# Altium schematic sheet HEADERS_1.SchDoc: HEADER
size 420 x 297 mm; SheetNumber: 3; SheetTotal: 12
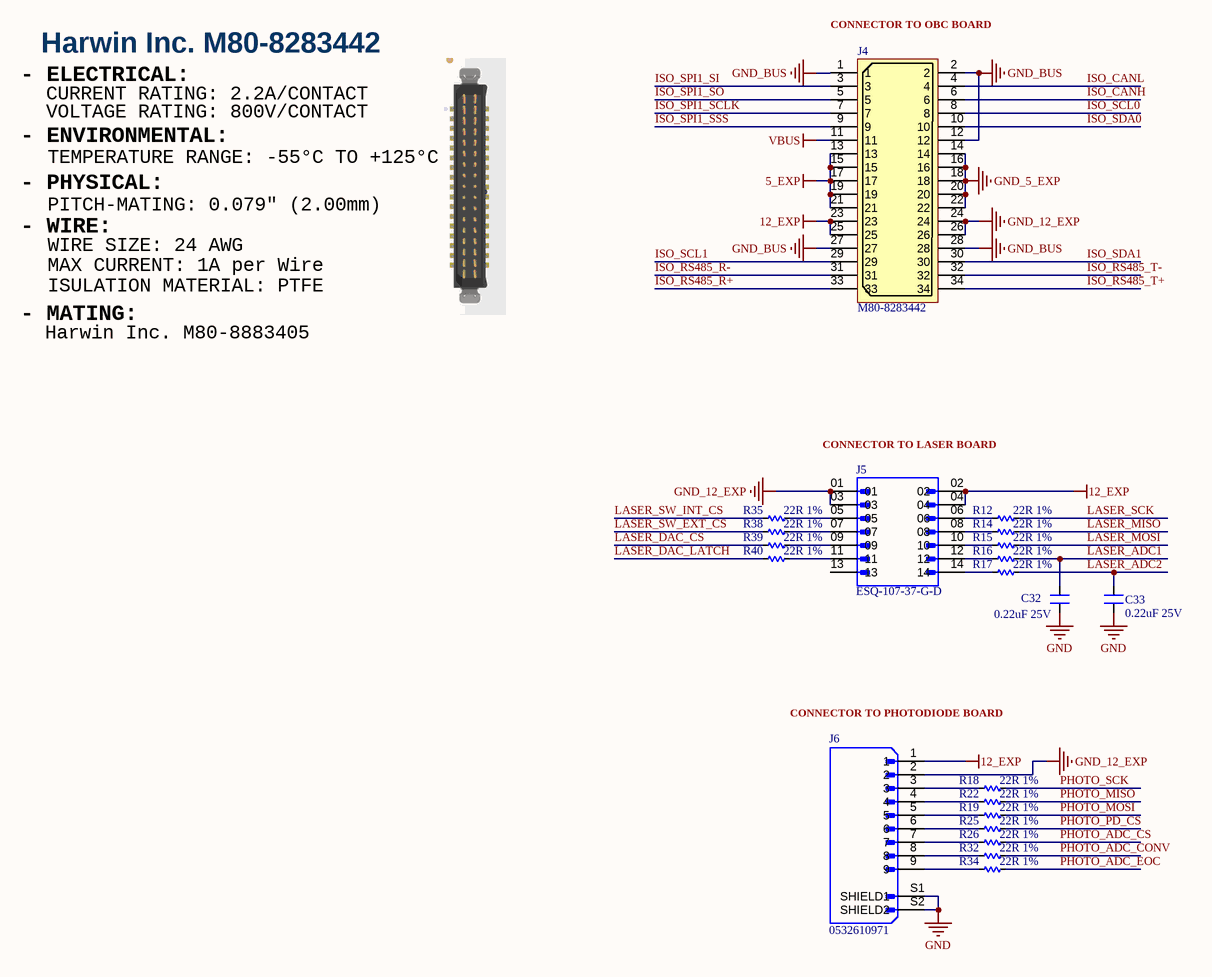
[diagram p0: HEADERS_1.SchDoc]

## Parts
C32  0.22uF 25V  [CN-SMD-0603-EXP-V101]
C33  0.22uF 25V  [CN-SMD-0603-EXP-V101]
J4  M80-8283442  [M80-8283442]
J5  ESQ-107-37-G-D  [ESQ-107-37-G-D]
J6  0532610971  [0532610971]
R12  22R 1%  [RES-SMD-0603-EXP-V101]
R14  22R 1%  [RES-SMD-0603-EXP-V101]
R15  22R 1%  [RES-SMD-0603-EXP-V101]
R16  22R 1%  [RES-SMD-0603-EXP-V101]
R17  22R 1%  [RES-SMD-0603-EXP-V101]
R18  22R 1%  [RES-SMD-0603-EXP-V101]
R19  22R 1%  [RES-SMD-0603-EXP-V101]
R22  22R 1%  [RES-SMD-0603-EXP-V101]
R25  22R 1%  [RES-SMD-0603-EXP-V101]
R26  22R 1%  [RES-SMD-0603-EXP-V101]
R32  22R 1%  [RES-SMD-0603-EXP-V101]
R34  22R 1%  [RES-SMD-0603-EXP-V101]
R35  22R 1%  [RES-SMD-0603-EXP-V101]
R38  22R 1%  [RES-SMD-0603-EXP-V101]
R39  22R 1%  [RES-SMD-0603-EXP-V101]
R40  22R 1%  [RES-SMD-0603-EXP-V101]

## Nets
5_EXP: J4.13 J4.15 J4.17 J4.19 J4.21
12_EXP: J4.23 J4.25 J5.02 J5.04 J6.1
GND: C32.1 C33.1 J6.S1(SHIELD1) J6.S2(SHIELD2)
GND_5_EXP: J4.14 J4.16 J4.18 J4.20 J4.22
GND_12_EXP: J4.24 J4.26 J5.01 J5.03 J6.2
GND_BUS: J4.1 J4.2 J4.12 J4.27 J4.28
VBUS: J4.11
ISO_CANH: J4.6
ISO_CANL: J4.4
ISO_RS485_R+: J4.33
ISO_RS485_R-: J4.31
ISO_RS485_T+: J4.34
ISO_RS485_T-: J4.32
ISO_SCL0: J4.8
ISO_SCL1: J4.29
ISO_SDA0: J4.10
ISO_SDA1: J4.30
ISO_SPI1_~{SSS}: J4.9
ISO_SPI1_SCLK: J4.7
ISO_SPI1_SI: J4.3
ISO_SPI1_SO: J4.5
LASER_ADC1: C32.2 R16.2
LASER_ADC2: C33.2 R17.2
LASER_DAC_CS: R39.1
LASER_DAC_LATCH: R40.1
LASER_MISO: R14.2
LASER_MOSI: R15.2
LASER_SCK: R12.2
LASER_SW_EXT_CS: R38.1
LASER_SW_INT_CS: R35.1
PHOTO_ADC_CONV: R32.2
PHOTO_ADC_CS: R26.2
PHOTO_ADC_EOC: R34.2
PHOTO_MISO: R22.2
PHOTO_MOSI: R19.2
PHOTO_PD_CS: R25.2
PHOTO_SCK: R18.2
NetJ5_05: J5.05 R35.2
NetJ5_06: J5.06 R12.1
NetJ5_07: J5.07 R38.2
NetJ5_08: J5.08 R14.1
NetJ5_09: J5.09 R39.2
NetJ5_10: J5.10 R15.1
NetJ5_11: J5.11 R40.2
NetJ5_12: J5.12 R16.1
NetJ5_14: J5.14 R17.1
NetJ6_3: J6.3 R18.1
NetJ6_4: J6.4 R22.1
NetJ6_5: J6.5 R19.1
NetJ6_6: J6.6 R25.1
NetJ6_7: J6.7 R26.1
NetJ6_8: J6.8 R32.1
NetJ6_9: J6.9 R34.1

Not connected (* = marked no-connect by the designer): J5 13

## Notes on the sheet
- (near J4) CONNECTOR TO OBC BOARD
- - ELECTRICAL:
- Harwin Inc. M80-8283442
- CURRENT RATING: 2.2A/CONTACT
- - ENVIRONMENTAL:
- VOLTAGE RATING: 800V/CONTACT
- TEMPERATURE RANGE: -55°C TO +125°C
- - PHYSICAL:
- - WIRE:
- PITCH-MATING: 0.079" (2.00mm)
- WIRE SIZE: 24 AWG
- MAX CURRENT: 1A per Wire
- ISULATION MATERIAL: PTFE
- - MATING:
- Harwin Inc. M80-8883405
- (near J5) CONNECTOR TO LASER BOARD
- (near J6) CONNECTOR TO PHOTODIODE BOARD
- Project:
- PEE-PC1
- Sub-system:
- NANORACK_EXP_CONTROLLER
- Design by:
- SANG HUYNH
- BAO BUI Q.
- Sheet title:
- Sheet
- A3
- of
- Checked by:
- Approved by:
- VU PHAM
- Revision:
- Document No:
- V1.0.0
- Size:
- Date:

## Library data of the parts
C32 C33 = Capacitors: Value: 33pF
J4 = M80-8283442: CONN HEADER SMD 34POS 2MM
J5 = CONN_TH_14: CONN SOCKET 14POS 0.1 GOLD PCB
J6 = CONN_SMD_09: CONN HEADER SMD R/A 9POS 1.25MM
R12 R14-R19 R22 R25 R26 R32 R34 R35 R38-R40 = Res SMD: SMD; Manufacturer: Generic Components; Class: Passive; Published: 08/06/2000; Publisher: Altium Hobart Technology Centre